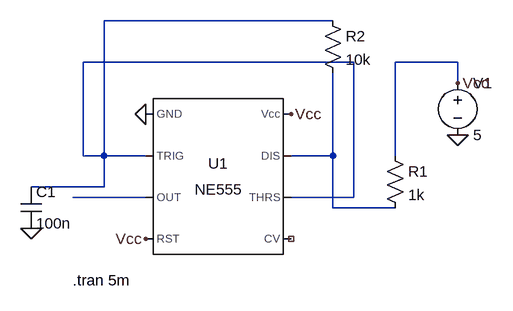
[diagram p0: schematic Project1Schematics.asc]
Project1Schematics.asc, the LTspice schematic file:
Version 4.1
SHEET 1 880 680
WIRE 400 -80 48 -80
WIRE 432 -16 16 -16
WIRE 592 -16 496 -16
WIRE 592 16 592 -16
WIRE 16 128 16 -16
WIRE 48 128 48 -80
WIRE 48 128 16 128
WIRE 112 128 48 128
WIRE 400 128 400 0
WIRE 400 128 336 128
WIRE 496 128 496 -16
WIRE 48 176 48 128
WIRE 48 176 -64 176
WIRE 112 192 0 192
WIRE 432 192 432 -16
WIRE 432 192 336 192
WIRE 400 208 400 128
WIRE 496 208 400 208
FLAG 112 64 0
FLAG 112 256 Vcc
FLAG 336 64 Vcc
FLAG 592 96 0
FLAG 592 16 Vcc
FLAG -64 240 0
SYMBOL Misc\\NE555 224 160 R0
SYMATTR InstName U1
SYMBOL voltage 592 0 R0
WINDOW 123 0 0 Left 0
WINDOW 39 0 0 Left 0
SYMATTR InstName V1
SYMATTR Value 5
SYMBOL res 480 112 R0
SYMATTR InstName R1
SYMATTR Value 1k
SYMBOL res 384 -96 R0
SYMATTR InstName R2
SYMATTR Value 10k
SYMBOL cap -80 176 R0
SYMATTR InstName C1
SYMATTR Value 100n
TEXT 0 320 Left 2 !.tran 5m

The netlist it stands for:
* Project1Schematics.asc
X§U1 0 N001 N003 Vcc NC_01 N001 N002 Vcc NE555  ; pins GND TRIG OUT RST CV THRS DIS Vcc
V1 Vcc 0 5
R1 Vcc N002 1k
R2 N001 N002 10k
C1 N001 0 100n
.tran 5m
.lib NE555.sub
.backanno
.end